# Altium schematic sheet TopLevel.SchDoc
size A4; SheetNumber: 1; SheetTotal: 1
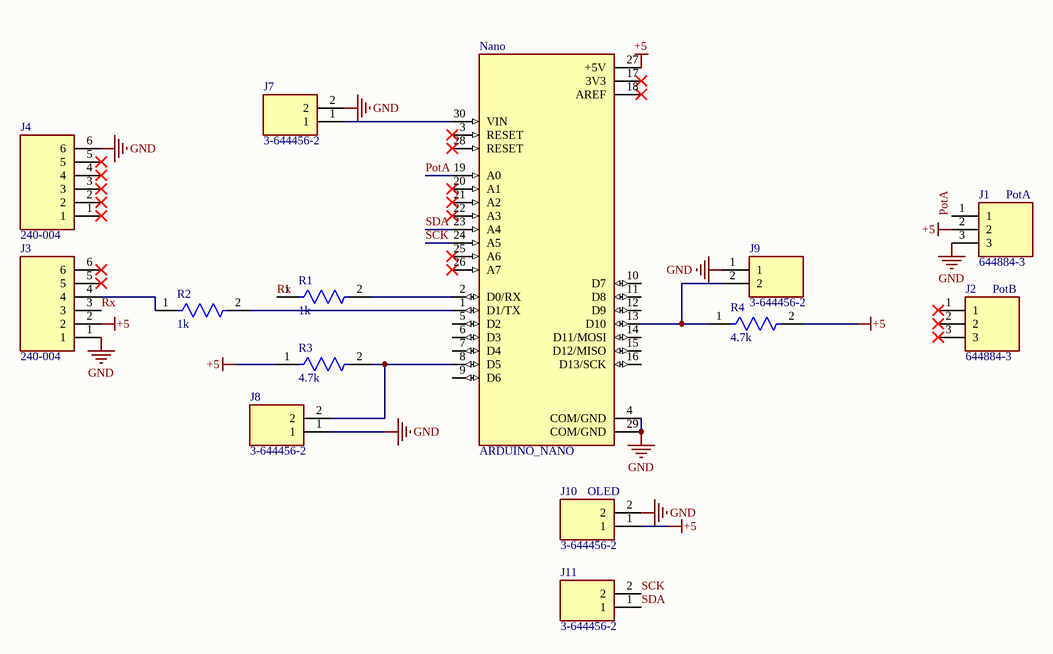
[diagram p0: TopLevel.SchDoc]

## Parts
J1  644884-3  [TE_644884-3]
J2  644884-3  [TE_644884-3]
J3  240-004  [HDRV6W64P0X254_1X6_1524X254X909P]
J4  240-004  [HDRV6W64P0X254_1X6_1524X254X909P]
J7  3-644456-2  [TE_3-644456-2]
J8  3-644456-2  [TE_3-644456-2]
J9  3-644456-2  [TE_3-644456-2]
J10  3-644456-2  [TE_3-644456-2]
J11  3-644456-2  [TE_3-644456-2]
Nano  ARDUINO_NANO  [SHIELD_ARDUINO_NANO]
R1  Resistance: 1k  [FP-MRS25-MFG]  (hidden comment: MRS25000C1001FCT00)
R2  Resistance: 1k  [FP-MRS25-MFG]  (hidden comment: MRS25000C1001FCT00)
R3  Resistance: 4.7k  [FP-MRS25-MFG]  (hidden comment: MRS25000C1001FCT00)
R4  Resistance: 4.7k  [FP-MRS25-MFG]  (hidden comment: MRS25000C1001FCT00)

## Nets
+5: J1.2 J3.2 J10.1 Nano.27(+5V) R3.1 R4.2
GND: J1.3 J3.1 J4.6 J7.2 J8.1 J9.1 J10.2 Nano.4(COM/GND) Nano.29(COM/GND)
PotA: J1.1 Nano.19(A0)
Rx: J3.3 R1.1
SCK: J11.2 Nano.24(A5)
SDA: J11.1 Nano.23(A4)
NetJ3_4: J3.4 R2.1
NetJ7_1: J7.1 Nano.30(VIN)
NetJ8_2: J8.2 Nano.8(D5) R3.2
NetJ9_2: J9.2 Nano.13(D10) R4.1
NetNano_1: Nano.1(D1/TX) R2.2
NetNano_2: Nano.2(D0/RX) R1.2

Not connected (* = marked no-connect by the designer): J2 1* 2* 3*; J3 5* 6*; J4 1* 2* 3* 4* 5*; Nano 3(RESET)* 5(D2) 6(D3) 7(D4) 9(D6) 10(D7) 11(D8) 12(D9) 14(D11/MOSI) 15(D12/MISO) 16(D13/SCK) 17(3V3)* 18(AREF)* 20(A1)* 21(A2)* 22(A3)* 25(A6)* 26(A7)* 28(RESET)*

## Notes on the sheet
- (near J1) PotA
- PotB
- (near J10) OLED

## Library data of the parts
J1 J2 = CMP-031-000000-1: Design Item ID: 644884-3; Price: None; Package: None; Value: *; Availability: Unavailable; Pin Count: 3; Source: 644884-3.SchLib; Component Type: Standard; MP: 644884-3
J3 J4 = 240-004: Connector; Manufacturer_Name: Digilent; Datasheet Link: https://digilent.com/reference/_media/reference/test-and-measurement/6-pin-header-gender-changer/163-068-2.pdf; Height: 9.09mm; Manufacturer_Part_Number: 240-004; Arrow Part Number: 240-004; Arrow Price/Stock: https://www.arrow.com/en/products/240-004/digilent?region=nac
J7-J11 = CMP-012-000001-1: Connector Unshrouded Header HDR 2 Position 2.54mm Solder Straight Thru-Hole; Centerline_Pitch: 2.54 mm[.1 in]; MF: TE Connectivity; Number_of_Positions: 2; TE_purchase_URL: https://www.te.com/usa-en/product-3-644456-2.html?te_bu=Cor&te_type=disp&te_campaign=seda_glo_cor-seda-global-disp-prtnr-fy19-seda-model-bom-cta_sma-317_1&elqCampaignId=32493; SnapEDA_Link: https://www.snapeda.com/parts/3-644456-2/TE%20Connectivity%20AMP%20Connectors/view-part/520887/?ref=snap; Digi-Key_Part_Number: A31112-ND; Component Type: Standard; EU_RoHS_Compliance: Compliant; Source: SnapEDAsch.SchLib; Pin Count: 2; Product_Type: Connector; Value: *; MP: 3-644456-2; Package: None; Digi-Key_Purchase_URL: https://www.digikey.com/product-detail/en/te-connectivity-amp-connectors/3-644456-2/A31112-ND/698344?utm_source=snapeda&utm_medium=aggregator&utm_campaign=symbol; Design Item ID: 3-644456-2
Nano = CMP-029-000000-1: Small, complete, and breadboard-friendly board based on the ATmega328 (Arduino Nano 3.x); Package: Non-Standard Arduino; Component Type: Standard; MF: Arduino; Design Item ID: ARDUINO_NANO; SnapEDA_Link: https://www.snapeda.com/parts/Arduino%20Nano/Arduino/view-part/?ref=snap; Value: *; Price: None; MP: Arduino Nano; Check_prices: https://www.snapeda.com/parts/Arduino%20Nano/Arduino/view-part/?ref=eda; Source: ARDUINO_NANO.SchLib; Pin Count: 30; Availability: Not in stock
R1-R4 = CMP-02408-000051-1: RES 1K OHM 0.6W 1% AXIAL; Power Rating: 600mW; Lead Diameter: 0.6mm; Voltage Rating (DC): 350V; Temperature Coefficient: 50ppm/°C; Width: 2.5mm; Military Standard: Not; Package Quantity: 5000; Radiation Hardening: No; Case/Package: Axial; Resistance Tolerance: 1%; Resistor Type: Metal Film; Contact Plating: Tin; Length: 6.5mm; Lead Free: Lead Free; RoHS Compliant: Yes; Mount: Through Hole; Number of Pins: 2; Technology: THIN FILM; Voltage Rating: 350V; Min Operating Temperature: -55°C; Weight: 0.00776oz; Diameter: 2.5mm; Construction: Cylindrical; Series: MRS25; Tolerance: 1%; Packaging: Tape and Reel; Max Operating Temperature: 155°C; Max Power Dissipation: 600mW; Number of Terminations: 2; Termination: Axial